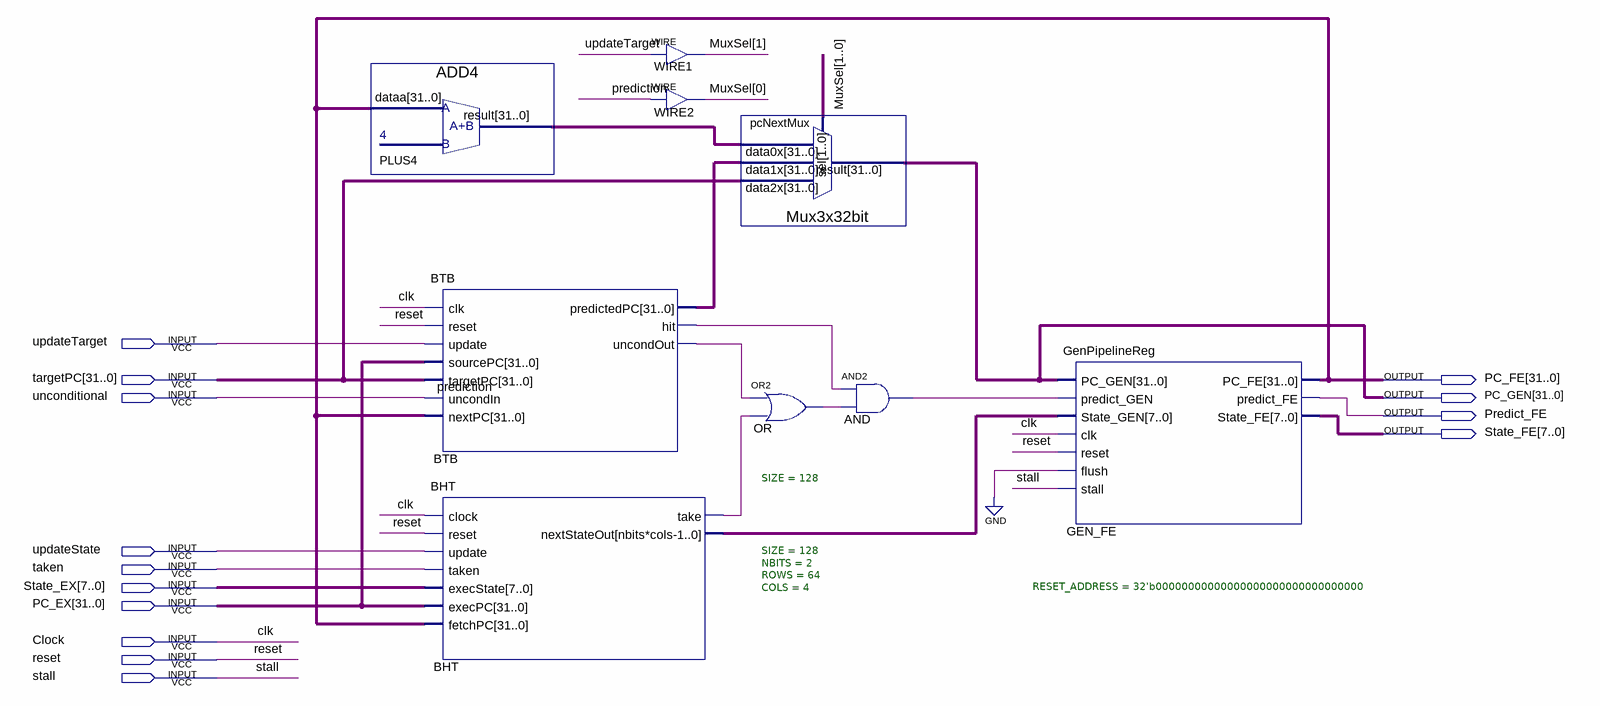
[diagram p0: schematic sheet]
// Quartus schematic FetchPrediction.bdf as structural Verilog: 9 symbols, 14 pins
module FetchPrediction (
  input  updateTarget,
  input  [31:0] targetPC,
  input  unconditional,
  input  updateState,
  input  taken,
  input  [7:0] State_EX,
  input  [31:0] PC_EX,
  input  Clock,
  input  reset,
  input  stall,
  output [31:0] PC_FE,
  output [31:0] PC_GEN,
  output Predict_FE,
  output [7:0] State_FE
);

  wire BHT_take, BTB_hit, BTB_uncondout, OR_out, prediction;
  wire [1:0] MuxSel;
  wire [7:0] BHT_nextstateout;
  wire [31:0] BTB_predictedpc, PLUS4_result;

  ADD4 PLUS4 (.dataa(PC_FE), .result(PLUS4_result));
  BTB #(.SIZE(128)) BTB (
    .clk(Clock), .reset(reset), .update(updateTarget), .sourcePC(PC_EX), .targetPC(targetPC),
    .uncondIn(unconditional), .nextPC(PC_FE), .predictedPC(BTB_predictedpc), .hit(BTB_hit),
    .uncondOut(BTB_uncondout));
  BHT #(.SIZE(128), .NBITS(2), .ROWS(64), .COLS(4)) BHT (
    .clock(Clock), .reset(reset), .update(updateState), .taken(taken), .execState(State_EX), .execPC(PC_EX),
    .fetchPC(PC_FE), .take(BHT_take), .nextStateOut(BHT_nextstateout));
  assign MuxSel[1] = updateTarget;  // WIRE WIRE1
  assign MuxSel[0] = prediction;  // WIRE WIRE2
  Mux3x32bit pcNextMux (
    .data2x(targetPC), .data1x(BTB_predictedpc), .data0x(PLUS4_result), .sel(MuxSel), .result(PC_GEN));
  or OR (OR_out, BTB_uncondout, BHT_take);
  and AND (prediction, BTB_hit, OR_out);
  GenPipelineReg #(.RESET_ADDRESS(32'b00000000000000000000000000000000)) GEN_FE (
    .PC_GEN(PC_GEN), .predict_GEN(prediction), .State_GEN(BHT_nextstateout), .clk(Clock), .reset(reset),
    .flush(1'b0), .stall(stall), .PC_FE(PC_FE), .predict_FE(Predict_FE), .State_FE(State_FE));

  // Other names for the same wires on the sheet: clk = Clock
endmodule
